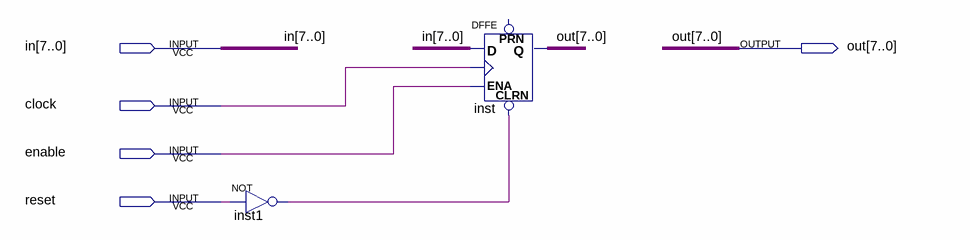
[diagram p0: schematic sheet]
// Quartus schematic mem8b.bdf as structural Verilog: 2 symbols, 5 pins
module mem8b (
  input  [7:0] in,
  input  clock,
  input  enable,
  input  reset,
  output [7:0] out
);

  wire inst1_out;

  not inst1 (inst1_out, reset);
  DFFE inst[7:0] (.CLRN(inst1_out), .D(in), .CLK(clock), .ENA(enable), .Q(out));  // open: PRN
endmodule
